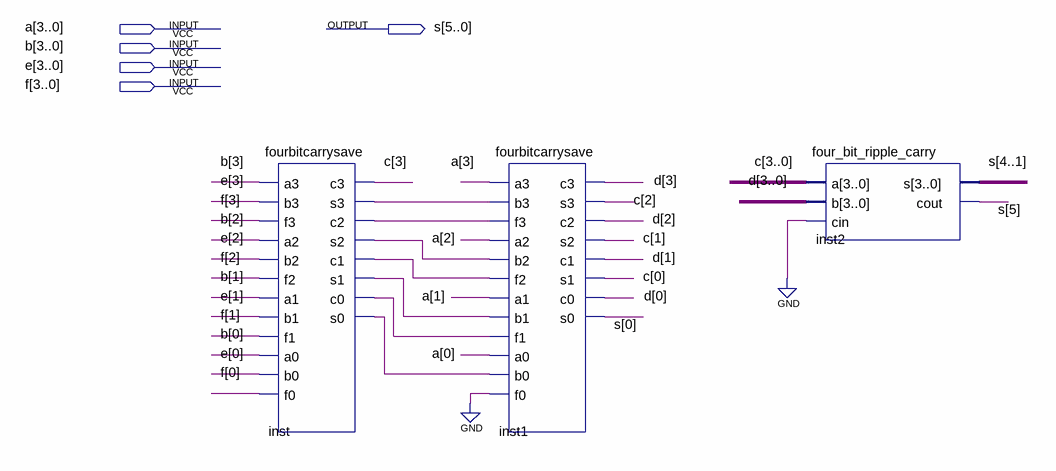
[diagram p0: schematic sheet]
// Quartus schematic four_number_carry_save.bdf as structural Verilog: 3 symbols, 5 pins
module four_number_carry_save (
  input  [3:0] a,
  input  [3:0] b,
  input  [3:0] e,
  input  [3:0] f,
  output [5:0] s
);

  wire inst_c0, inst_c1, inst_c2, inst_s0, inst_s1, inst_s2, inst_s3;
  wire [3:0] c, d;

  fourbitcarrysave inst (
    .a3(b[3]), .b3(e[3]), .f3(f[3]), .a2(b[2]), .b2(e[2]), .f2(f[2]), .a1(b[1]), .b1(e[1]), .f1(f[1]),
    .a0(b[0]), .b0(e[0]), .f0(f[0]), .c3(c[3]), .s3(inst_s3), .c2(inst_c2), .s2(inst_s2), .c1(inst_c1),
    .s1(inst_s1), .c0(inst_c0), .s0(inst_s0));
  fourbitcarrysave inst1 (
    .a3(a[3]), .b3(inst_s3), .f3(inst_c2), .a2(a[2]), .b2(inst_s2), .f2(inst_c1), .a1(a[1]), .b1(inst_s1),
    .f1(inst_c0), .a0(a[0]), .b0(inst_s0), .f0(1'b0), .c3(d[3]), .s3(c[2]), .c2(d[2]), .s2(c[1]), .c1(d[1]),
    .s1(c[0]), .c0(d[0]), .s0(s[0]));
  four_bit_ripple_carry inst2 (.a(c), .b(d), .cin(1'b0), .s(s[4:1]), .cout(s[5]));
endmodule
